# Altium schematic sheet Detector.SchDoc
size A4
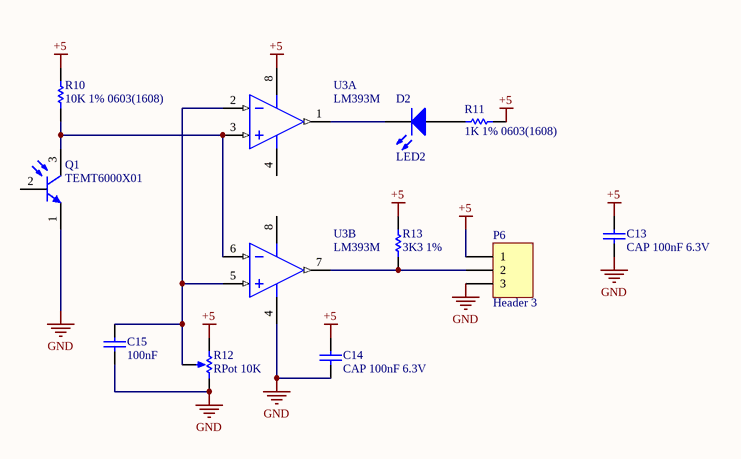
[diagram p0: Detector.SchDoc]

## Parts
C13  CAP 100nF 6.3V  [CAPC0603(1608)100_N]
C14  CAP 100nF 6.3V  [CAPC0603(1608)100_N]
C15  100nF  [CAPC0603(1608)100_N]
D2  LED2  [0603]
P6  Header 3  [PH2.0-WS-3P]
Q1  TEMT6000X01  [VSIL-TEMT6000X01_V]
R10  10K 1% 0603(1608)  [RESC0603(1608)_N]
R11  1K 1% 0603(1608)  [RESC0603(1608)_N]
R12  RPot 10K  [BOUR-3362P]
R13  3K3 1%  [RESC0603(1608)_N]
U3  LM393M  [M08A_N]  (parts A,B of 2)

## Nets
+5: C13.2 C14.2 P6.1 R10.2 R11.2 R12.1(TOP) R13.2 U3.8(V+)
GND: C13.1 C14.1 C15.1 P6.3 Q1.1(E) R12.3(BOT) U3.4(GND)
NetC15_2: C15.2 R12.2(TAP) U3.2(INA-) U3.5(INB+)
NetD2_1: D2.1(A) R11.1
NetD2_2: D2.2(K) U3.1(OUTA)
NetP6_2: P6.2 R13.1 U3.7(OUTB)
NetQ1_3: Q1.3(C) R10.1 U3.3(INA+) U3.6(INB-)

Not connected (* = marked no-connect by the designer): Q1 2(B)

## Library data of the parts
C13-C15 = CMP-1035-02576-1: CAP 100nF 6.3V ±10% 0603 (1608 Metric) Thickness 1mm SMD; Tolerance: Â±10%; Case-Metric: 1608; Case-EIA: 0603; Max Thickness: 1 mm; Value: 100nF; Rated Voltage: 6.3 V; Technology: SMT
D2 = LED2: Typical RED, GREEN, YELLOW, AMBER GaAs LED; Published: 8-Jun-2000; LatestRevisionDate: 17-Jul-2002; LatestRevisionNote: Re-released for DXP Platform.; PackageVersion: Feb-2002; PackageReference: 3.2X1.6X1.1; Publisher: Altium Limited; PackageDescription: SM LED; 2 Flat Leads
P6 = Header 3: Header, 3-Pin; LatestRevisionDate: 17-Jul-2002; LatestRevisionNote: Re-released for DXP Platform.; Publisher: Altium Limited
Q1 = CMP-1666-00035-1: Ambient Light Sensor / , 100 mW, -40 to 100 degC, 3-Pin SMD, RoHS, Tape and Reel; Nominal Vf: 2 V; Luminous Intensity: 54 mcd; Forward Current: 20 mA; Viewing Angle: 130 degrees; Lens Style: Diffused; Power Rating: 75 mW; Colour: Red; Case\Package: 0603; Case Code (Imperial): 0603; Package Quantity: 3000; Packaging: Tape and Reel; Width: 0.8 mm; ComponentLink2URL: http://www.vishay.com/docs/81579/temt6000.pdf; ComponentLink1Description: Manufacturer URL; ComponentLink2Description: Datasheet; Height: 0.8 mm; Mount: Surface Mount; Pins: 2; Case Code (Metric): 1608; Max Operating Temperature: 85 degC; DatasheetVersion: Rev. 1.9, 08/2011; Forward Voltage: 2 V; ComponentLink1URL: http://www.vishay.com/; Radiation Hardening: No; RoHSCompliant: true; Length: 1.6 mm; PackageReference: 1206; Min Operating Temperature: -55 degC; PackageDescription: 3-Pin Surface Mount Device, Body 4 x 2 mm; Illumination Colour: Red
R10 = CMP-1012-00623-1: 10K 0.1W 1% 0603 (1608 Metric)  SMD; Value: 10000.00 Ohm; Case-EIA: 0603; Case-Metric: 1608; Power: 0.1 W; Tolerance: 1 %; Technology: SMT
R11 = CMP-1012-00510-1: 1K 0.1W 1% 0603 (1608 Metric)  SMD; Case-Metric: 1608; Case-EIA: 0603; Value: 1000.00 Ohm; Technology: SMT; Tolerance: 1 %; Power: 0.1 W
R12 = RPot: Potentiometer; Sim Note: Enter the Resistance value and the set point into parameter fields.; Set Position: 0.5; Published: 8-Jun-2000; LatestRevisionDate: 17-Jul-2002; LatestRevisionNote: Re-released for DXP Platform.; PackageReference: VR5; Publisher: Altium Limited; PackageDescription: Variable Resistor, Thru-Hole; 3 Leads
R13 = CMP-1012-00567-1: 3K3 0.1W 1% 0603 (1608 Metric)  SMD; Case-Metric: 1608; Value: 3300.00 Ohm; Case-EIA: 0603; Power: 0.1 W; Tolerance: 1 %; Technology: SMT
U3 = CMP-0055-00682-2: Low Power Low Offset Voltage Dual Comparator, 8-pin Narrow SOIC; Manufacturer: National Semiconductor; CompType: Amplifiers; PackageTopMarking: NSZXTT*LM*393M; PowerWise: N; Code_IPC: SOIC127P600-8; PackageReference: M08A; Code_JEDEC: MS-012-AA; ComponentLink1URL: http://www.national.com/ds/LM/LM393.pdf; PinCount: 8; DatasheetVersion: Aug-2002; RevisionNote: Component URLs added; ComponentLink2URL: http://www.national.com/pf/LM/LM393.html; RoHS: N; ComponentLink2Description: LM393 Web Page; ComponentLink3URL: http://www.national.com/packaging/folders/m08a.html; PackageVersion: revM, May-2009; PackageDescription: SOIC Narrow, 4.9 x 3.9 x 1.45mm, 8 Lead, 1.27mm Pitch; ComponentLink3Description: M08A Package Page; ComponentLink1Description: LM393 Datasheet; PartId: 1